# Altium schematic sheet Light Detector CCT.SchDoc
size A4; SheetNumber: 2; SheetTotal: 2
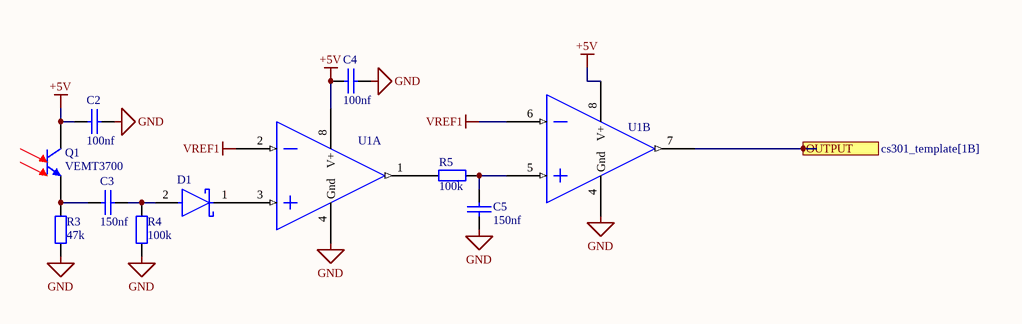
[diagram p0: Light Detector CCT.SchDoc]

## Parts
C2  100nf  [0805 CAP]
C3  150nf  [0805 CAP]
C4  100nf  [0805 CAP]
C5  150nf  [0805 CAP]
D1  (no value)  [FP-SOD68-MFG]
Q1  VEMT3700  [VEMT3700]
R3  47k  [0805 RES]
R4  100k  [0805 RES]
R5  100k  [0805 RES]
U1  TLC082  [ECE-SOIC8]  (value not drawn)  (parts A,B of 2)

## Ports
OUTPUT (out, see cs301_template[1B])

## Nets
+5V: C2.1 C4.1 Q1.1(C) U1.8(V+)
GND: C2.2 C4.2 C5.2 R3.1 R4.1 U1.4(Gnd)
VREF1: U1.2(IN1(-)) U1.6(IN2(-))
OUTPUT: U1.7(OUT2) ; port OUTPUT
NetC3_1: C3.1 Q1.2(E) R3.2
NetC3_2: C3.2 D1.2(A) R4.2
NetC5_1: C5.1 R5.2 U1.5(IN2(+))
NetD1_1: D1.1(C) U1.3(IN1(+))
NetR5_1: R5.1 U1.1(OUT1)

## Library data of the parts
C2-C5 = CerCap_SMT_0805: SMT ceramic capacitor 0805 size; Value: *
D1 = CMP-14398-000042-1: DIODE SCHOTTKY 30V 200MA DO34; RoHS Compliant: Yes
Q1 = VEMT3700: Silicon NPN Phototransistor
R3-R5 = Res_SMT_0805: 0805 resistor; Published: 8-Jun-2000; LatestRevisionDate: 17-Jul-2002; LatestRevisionNote: Re-released for DXP Platform.; PackageReference: AXIAL-0.4; Publisher: Altium Limited; Value: *; ComponentLink1Description: https://nz.mouser.com/datasheet/2/315/AOA0000C304-1149620.pdf
U1 = OPA000103: IC OPAMP TLC082 GP 10MHZ 8SOIC; Manufactuer: Texas Instruments; Manufacturer-PN: TLC082IDR; Assembly Method: Surface Mount; Item Type: Item; Path: ece/ts/Lists/Stock Inventory; UoA Stock#: OPA000103; Value: TLC082; Size/Package: SOIC 8; Datasheet Link: http://share.engineering.auckland.ac.nz/ece/ts/Student%20Documents/TLC082.pdf; Supplier1: Digikey; Supplier1-PN: 296-7271-6-ND; Component Type: SOIC18-TLC082; Category: OpAmp; Status: Active